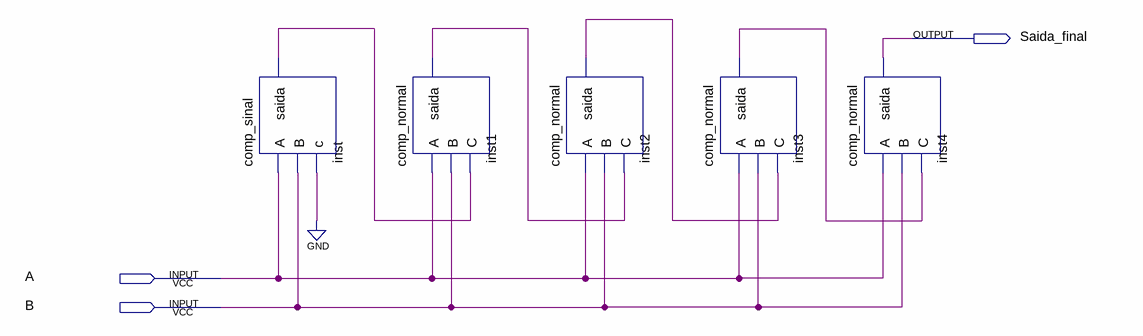
[diagram p0: schematic sheet]
// Quartus schematic comp_maior_5bits.bdf as structural Verilog: 5 symbols, 3 pins
module comp_maior_5bits (
  input  A,
  input  B,
  output Saida_final
);

  wire inst1_saida, inst2_saida, inst3_saida, inst_saida;

  comp_sinal inst (.A(A), .B(B), .c(1'b0), .saida(inst_saida));
  comp_normal inst1 (.A(A), .B(B), .C(inst_saida), .saida(inst1_saida));
  comp_normal inst2 (.A(A), .B(B), .C(inst1_saida), .saida(inst2_saida));
  comp_normal inst3 (.A(A), .B(B), .C(inst2_saida), .saida(inst3_saida));
  comp_normal inst4 (.A(A), .B(B), .C(inst3_saida), .saida(Saida_final));
endmodule
